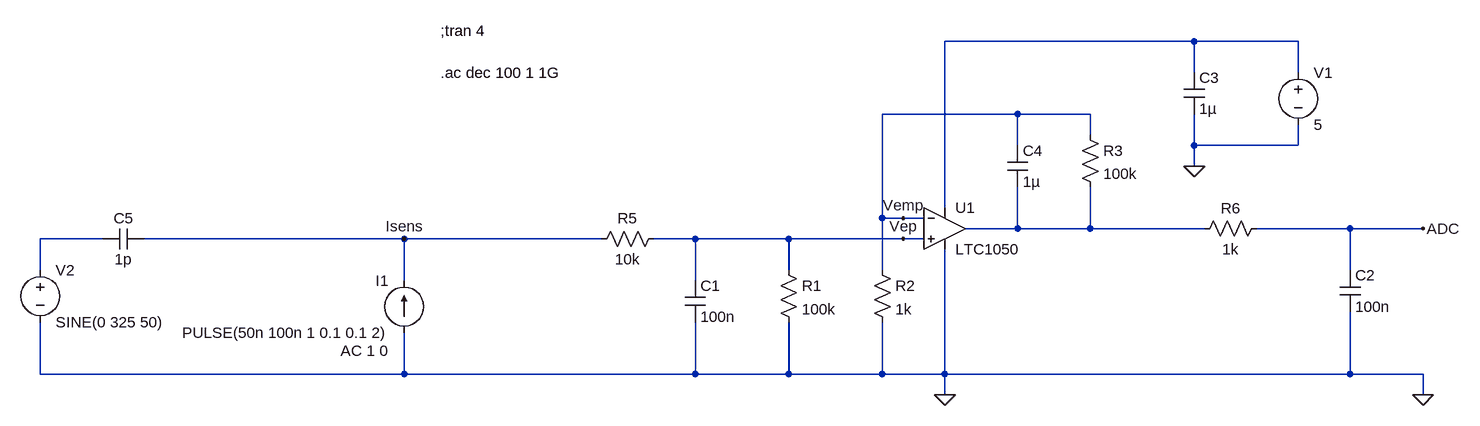
[diagram p0: schematic Circuit sans capteur.asc]
Circuit sans capteur.asc, the LTspice schematic file:
Version 4
SHEET 1 880 680
WIRE 192 16 -192 16
WIRE 352 16 192 16
WIRE 192 64 192 16
WIRE 352 64 352 16
WIRE -80 128 -288 128
WIRE 32 128 -80 128
WIRE 32 160 32 128
WIRE -80 176 -80 128
WIRE 192 176 192 128
WIRE 352 176 352 144
WIRE 352 176 192 176
WIRE 192 208 192 176
WIRE -192 272 -192 16
WIRE -288 288 -288 128
WIRE -256 288 -288 288
WIRE -224 288 -256 288
WIRE -80 304 -80 240
WIRE -80 304 -160 304
WIRE 32 304 32 240
WIRE 32 304 -80 304
WIRE 208 304 32 304
WIRE 432 304 288 304
WIRE 544 304 432 304
WIRE -1488 320 -1584 320
WIRE -1024 320 -1424 320
WIRE -720 320 -1024 320
WIRE -576 320 -640 320
WIRE -432 320 -576 320
WIRE -256 320 -432 320
WIRE -224 320 -256 320
WIRE -1584 368 -1584 320
WIRE -432 368 -432 320
WIRE -288 368 -288 288
WIRE 432 368 432 304
WIRE -1024 384 -1024 320
WIRE -576 384 -576 320
WIRE -1584 528 -1584 448
WIRE -1024 528 -1024 464
WIRE -1024 528 -1584 528
WIRE -576 528 -576 448
WIRE -576 528 -1024 528
WIRE -432 528 -432 448
WIRE -432 528 -576 528
WIRE -288 528 -288 448
WIRE -288 528 -432 528
WIRE -192 528 -192 336
WIRE -192 528 -288 528
WIRE 432 528 432 432
WIRE 432 528 -192 528
WIRE 544 528 432 528
WIRE -192 560 -192 528
WIRE 544 560 544 528
FLAG -192 560 0
FLAG 544 560 0
FLAG 192 208 0
FLAG -1024 320 Isens
FLAG 544 304 ADC
FLAG -256 288 Vemp
FLAG -256 320 Vep
SYMBOL voltage 352 48 R0
WINDOW 123 0 0 Left 0
WINDOW 39 0 0 Left 0
SYMATTR InstName V1
SYMATTR Value 5
SYMBOL OpAmps\\LTC1050 -192 240 R0
SYMATTR InstName U1
SYMBOL res 16 144 R0
SYMATTR InstName R3
SYMATTR Value 100k
SYMBOL cap -96 176 R0
SYMATTR InstName C4
SYMATTR Value 1µ
SYMBOL res 304 288 R90
WINDOW 0 0 56 VBottom 2
WINDOW 3 32 56 VTop 2
SYMATTR InstName R6
SYMATTR Value 1k
SYMBOL res -304 352 R0
SYMATTR InstName R2
SYMATTR Value 1k
SYMBOL res -448 352 R0
SYMATTR InstName R1
SYMATTR Value 100k
SYMBOL cap -592 384 R0
SYMATTR InstName C1
SYMATTR Value 100n
SYMBOL res -624 304 R90
WINDOW 0 0 56 VBottom 2
WINDOW 3 32 56 VTop 2
SYMATTR InstName R5
SYMATTR Value 10k
SYMBOL current -1024 464 R180
WINDOW 0 24 80 Left 2
WINDOW 3 24 0 Left 2
WINDOW 123 24 -28 Left 2
WINDOW 39 0 0 Left 0
SYMATTR InstName I1
SYMATTR Value PULSE(50n 100n 1 0.1 0.1 2)
SYMATTR Value2 AC 1 0
SYMBOL cap 416 368 R0
SYMATTR InstName C2
SYMATTR Value 100n
SYMBOL cap 176 64 R0
SYMATTR InstName C3
SYMATTR Value 1µ
SYMBOL voltage -1584 352 R0
WINDOW 123 0 0 Left 0
WINDOW 39 0 0 Left 0
SYMATTR InstName V2
SYMATTR Value SINE(0 325 50)
SYMBOL cap -1424 304 R90
WINDOW 0 0 32 VBottom 2
WINDOW 3 32 32 VTop 2
SYMATTR InstName C5
SYMATTR Value 1p
TEXT -968 0 Left 2 !;tran 4
TEXT -968 64 Left 2 !.ac dec 100 1 1G

The netlist it stands for:
* Circuit sans capteur.asc
V1 N001 0 5
XU1 Vep Vemp N001 0 N002 LTC1050  ; pins In+ In- V+ V- OUT
R3 Vemp N002 100k
C4 Vemp N002 1µ
R6 ADC N002 1k
R2 Vemp 0 1k
R1 Vep 0 100k
C1 Vep 0 100n
R5 Vep Isens 10k
I1 0 Isens PULSE(50n 100n 1 0.1 0.1 2) AC 1 0
C2 ADC 0 100n
C3 N001 0 1µ
V2 N003 0 SINE(0 325 50)
C5 Isens N003 1p
;tran 4
.ac dec 100 1 1G
.lib LTC.lib
.backanno
.end